# EAGLE schematic MAR (EAGLE 5.11)
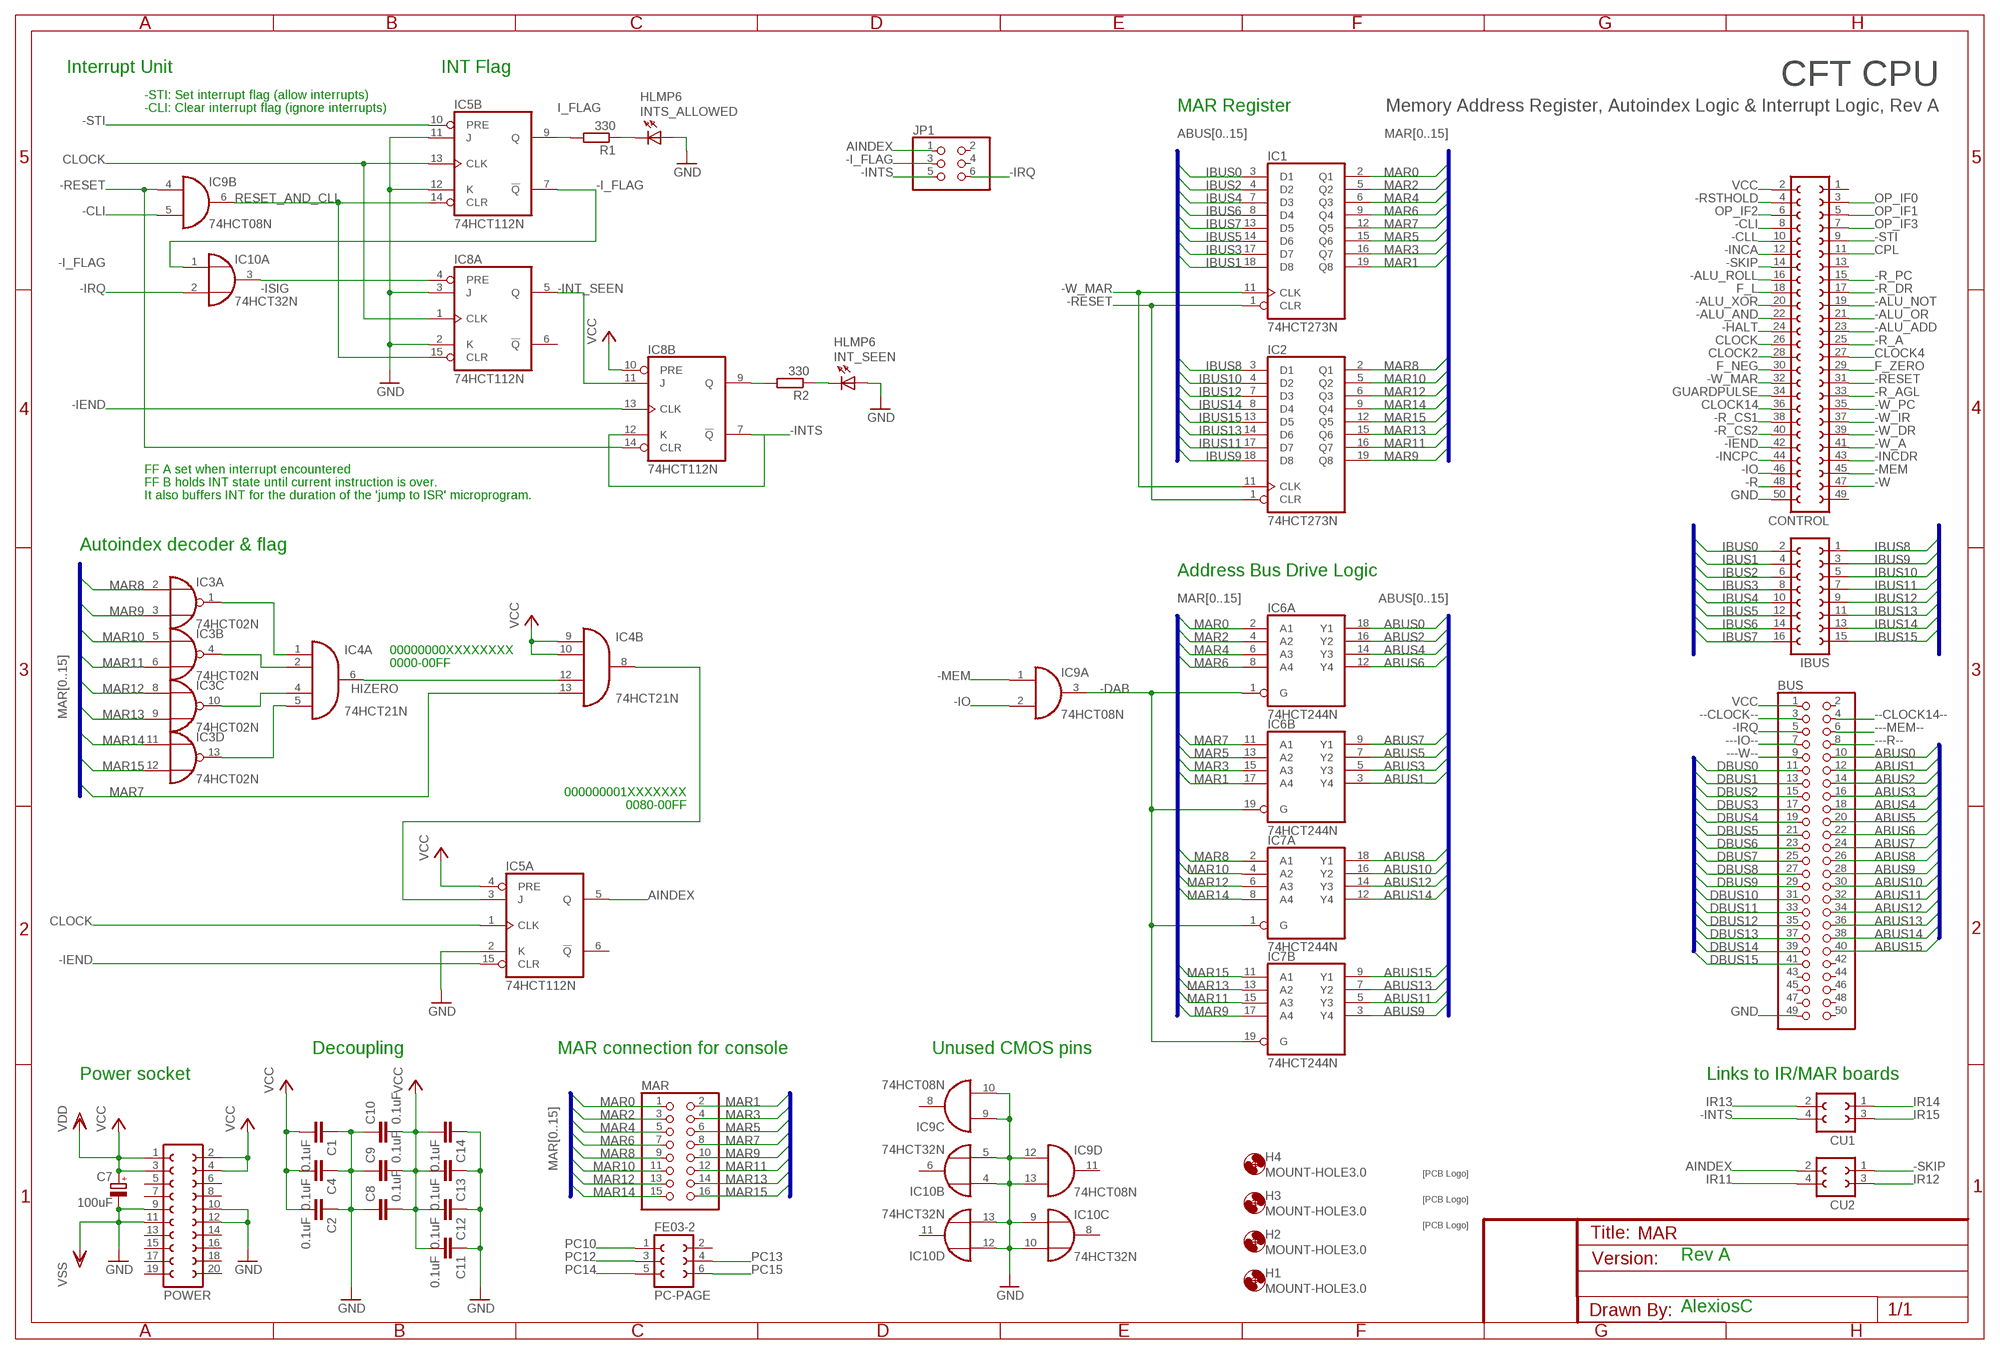
[diagram p0: schematic, sheet 1]

## Parts
BUS  PINHD-2X25/90  [2X25/90]
C1  0.1uF  C-EU025-025X050  [C025-025X050]
C2  0.1uF  C-EU025-025X050  [C025-025X050]
C4  0.1uF  C-EU025-025X050  [C025-025X050]
C7  100uF  CPOL-EUE2.5-6  [E2,5-6]
C8  0.1uF  C-EU025-025X050  [C025-025X050]
C9  0.1uF  C-EU025-025X050  [C025-025X050]
C10  0.1uF  C-EU025-025X050  [C025-025X050]
C11  0.1uF  C-EU025-025X050  [C025-025X050]
C12  0.1uF  C-EU025-025X050  [C025-025X050]
C13  0.1uF  C-EU025-025X050  [C025-025X050]
C14  0.1uF  C-EU025-025X050  [C025-025X050]
CONTROL  FE25-2  [FE25-2]
CU1  FE02-2  [FE02-2]
CU2  FE02-2  [FE02-2]
H1  MOUNT-HOLE3.0  [3,0]
H2  MOUNT-HOLE3.0  [3,0]
H3  MOUNT-HOLE3.0  [3,0]
H4  MOUNT-HOLE3.0  [3,0]
IBUS  FE08-2  [FE08-2]
IC1  74HCT273N  [DIL20]
IC2  74HCT273N  [DIL20]
IC3  74HCT02N  [DIL14]
IC4  74HCT21N  [DIL14]
IC5  74HCT112N  [DIL16]
IC6  74HCT244N  [DIL20]
IC7  74HCT244N  [DIL20]
IC8  74HCT112N  [DIL16]
IC9  74HCT08N  [DIL14]
IC10  74HCT32N  [DIL14]
INT_SEEN  HLMP6  [HLMP6]
INTS_ALLOWED  HLMP6  [HLMP6]
JP1  PINHD-2X3/90  [2X03/90]
MAR  PINHD-2X8/90  [2X08/90]
PC-PAGE  FE03-2  [FE03-2]
POWER  FE10-2  [FE10-2]
R1  330  R-EU_0204/7  [0204/7]
R2  330  R-EU_0204/7  [0204/7]
U$1  SIGNATUREPLANE  [SIGNATURE_PLANE]
U$2  SIGNATUREPLANE  [SIGNATURE_PLANE]
U$3  SIGNATURESILK  [SIGNATURE]

## Nets
---IO--: BUS.7
---MEM--: BUS.6
---R--: BUS.8
---W--: BUS.9
--CLOCK14--: BUS.4
--CLOCK--: BUS.3
-ALU_ADD: CONTROL.23
-ALU_AND: CONTROL.22
-ALU_NOT: CONTROL.19
-ALU_OR: CONTROL.21
-ALU_ROLL: CONTROL.16
-ALU_XOR: CONTROL.20
-CLI: CONTROL.8 IC9.5(B:I1)
-CLL: CONTROL.10
-DAB: IC6.1(A:G) IC6.19(B:G) IC7.1(A:G) IC7.19(B:G) IC9.3(A:O)
-HALT: CONTROL.24
-I_FLAG: IC5.7(B:!Q) IC10.1(A:I0) JP1.3
-IEND: CONTROL.42 IC5.15(A:CLR) IC8.13(B:CLK)
-INCA: CONTROL.12
-INCDR: CONTROL.43
-INCPC: CONTROL.44
-INT_SEEN: IC8.5(A:Q) IC8.11(B:J)
-INTS: CU1.4 IC8.7(B:!Q) IC8.12(B:K) JP1.5
-IO: CONTROL.46 IC9.2(A:I1)
-IRQ: BUS.5 IC10.2(A:I1) JP1.6
-ISIG: IC8.4(A:PRE) IC10.3(A:O)
-MEM: CONTROL.45 IC9.1(A:I0)
-R: CONTROL.48
-R_A: CONTROL.25
-R_AGL: CONTROL.33
-R_CS1: CONTROL.38
-R_CS2: CONTROL.40
-R_DR: CONTROL.17
-R_PC: CONTROL.15
-RESET: CONTROL.31 IC1.1(CLR) IC2.1(CLR) IC8.14(B:CLR) IC9.4(B:I0)
-RSTHOLD: CONTROL.4
-SKIP: CONTROL.14 CU2.1
-STI: CONTROL.9 IC5.10(B:PRE)
-W: CONTROL.47
-W_A: CONTROL.41
-W_DR: CONTROL.39
-W_IR: CONTROL.37
-W_MAR: CONTROL.32 IC1.11(CLK) IC2.11(CLK)
-W_PC: CONTROL.35
ABUS0: BUS.10 IC6.18(A:Y1)
ABUS1: BUS.12 IC6.3(B:Y4)
ABUS2: BUS.14 IC6.16(A:Y2)
ABUS3: BUS.16 IC6.5(B:Y3)
ABUS4: BUS.18 IC6.14(A:Y3)
ABUS5: BUS.20 IC6.7(B:Y2)
ABUS6: BUS.22 IC6.12(A:Y4)
ABUS7: BUS.24 IC6.9(B:Y1)
ABUS8: BUS.26 IC7.18(A:Y1)
ABUS9: BUS.28 IC7.3(B:Y4)
ABUS10: BUS.30 IC7.16(A:Y2)
ABUS11: BUS.32 IC7.5(B:Y3)
ABUS12: BUS.34 IC7.14(A:Y3)
ABUS13: BUS.36 IC7.7(B:Y2)
ABUS14: BUS.38 IC7.12(A:Y4)
ABUS15: BUS.40 IC7.9(B:Y1)
AINDEX: CU2.2 IC5.5(A:Q) JP1.1
CLOCK: CONTROL.26 IC5.1(A:CLK) IC5.13(B:CLK) IC8.1(A:CLK)
CLOCK2: CONTROL.28
CLOCK4: CONTROL.27
CLOCK14: CONTROL.36
CPL: CONTROL.11
DBUS0: BUS.11
DBUS1: BUS.13
DBUS2: BUS.15
DBUS3: BUS.17
DBUS4: BUS.19
DBUS5: BUS.21
DBUS6: BUS.23
DBUS7: BUS.25
DBUS8: BUS.27
DBUS9: BUS.29
DBUS10: BUS.31
DBUS11: BUS.33
DBUS12: BUS.35
DBUS13: BUS.37
DBUS14: BUS.39
DBUS15: BUS.41
F_L: CONTROL.18
F_NEG: CONTROL.30
F_ZERO: CONTROL.29
GND: BUS.49 C1.1 C2.1 C4.1 C7.- C8.1 C9.1 C10.1 C11.1 C12.1 C13.1 C14.1 CONTROL.50 IC5.2(A:K) IC5.11(B:J) IC5.12(B:K) IC8.2(A:K) IC8.3(A:J) IC9.9(C:I0) IC9.10(C:I1) IC9.12(D:I0) IC9.13(D:I1) IC10.4(B:I0) IC10.5(B:I1) IC10.9(C:I0) IC10.10(C:I1) IC10.12(D:I0) IC10.13(D:I1) INT_SEEN.A INTS_ALLOWED.A POWER.9 POWER.10 POWER.11 POWER.12 ; supply symbol labelled VSS
GUARDPULSE: CONTROL.34
HIZERO: IC4.6(A:O) IC4.12(B:I2)
I_FLAG: IC5.9(B:Q) R1.2
IBUS0: IBUS.2 IC1.3(D1)
IBUS1: IBUS.4 IC1.18(D8)
IBUS2: IBUS.6 IC1.4(D2)
IBUS3: IBUS.8 IC1.17(D7)
IBUS4: IBUS.10 IC1.7(D3)
IBUS5: IBUS.12 IC1.14(D6)
IBUS6: IBUS.14 IC1.8(D4)
IBUS7: IBUS.16 IC1.13(D5)
IBUS8: IBUS.1 IC2.3(D1)
IBUS9: IBUS.3 IC2.18(D8)
IBUS10: IBUS.5 IC2.4(D2)
IBUS11: IBUS.7 IC2.17(D7)
IBUS12: IBUS.9 IC2.7(D3)
IBUS13: IBUS.11 IC2.14(D6)
IBUS14: IBUS.13 IC2.8(D4)
IBUS15: IBUS.15 IC2.13(D5)
INTS: IC8.9(B:Q) R2.2
IR11: CU2.4
IR12: CU2.3
IR13: CU1.2
IR14: CU1.1
IR15: CU1.3
MAR0: IC1.2(Q1) IC6.2(A:A1) MAR.1
MAR1: IC1.19(Q8) IC6.17(B:A4) MAR.2
MAR2: IC1.5(Q2) IC6.4(A:A2) MAR.3
MAR3: IC1.16(Q7) IC6.15(B:A3) MAR.4
MAR4: IC1.6(Q3) IC6.6(A:A3) MAR.5
MAR5: IC1.15(Q6) IC6.13(B:A2) MAR.6
MAR6: IC1.9(Q4) IC6.8(A:A4) MAR.7
MAR7: IC1.12(Q5) IC4.13(B:I3) IC6.11(B:A1) MAR.8
MAR8: IC2.2(Q1) IC3.2(A:I0) IC7.2(A:A1) MAR.9
MAR9: IC2.19(Q8) IC3.3(A:I1) IC7.17(B:A4) MAR.10
MAR10: IC2.5(Q2) IC3.5(B:I0) IC7.4(A:A2) MAR.11
MAR11: IC2.16(Q7) IC3.6(B:I1) IC7.15(B:A3) MAR.12
MAR12: IC2.6(Q3) IC3.8(C:I0) IC7.6(A:A3) MAR.13
MAR13: IC2.15(Q6) IC3.9(C:I1) IC7.13(B:A2) MAR.14
MAR14: IC2.9(Q4) IC3.11(D:I0) IC7.8(A:A4) MAR.15
MAR15: IC2.12(Q5) IC3.12(D:I1) IC7.11(B:A1) MAR.16
N$1: IC3.1(A:O) IC4.1(A:I0)
N$2: IC3.4(B:O) IC4.2(A:I1)
N$3: IC3.10(C:O) IC4.4(A:I2)
N$4: IC3.13(D:O) IC4.5(A:I3)
N$5: IC4.8(B:O) IC5.3(A:J)
N$6: INT_SEEN.K R2.1
N$7: INTS_ALLOWED.K R1.1
OP_IF0: CONTROL.3
OP_IF1: CONTROL.5
OP_IF2: CONTROL.6
OP_IF3: CONTROL.7
PC10: PC-PAGE.1
PC12: PC-PAGE.3
PC13: PC-PAGE.4
PC14: PC-PAGE.5
PC15: PC-PAGE.6
RESET_AND_CLI: IC5.14(B:CLR) IC8.15(A:CLR) IC9.6(B:O)
VCC: BUS.1 C1.2 C2.2 C4.2 C7.+ C8.2 C9.2 C10.2 C11.2 C12.2 C13.2 C14.2 CONTROL.2 IC4.9(B:I0) IC4.10(B:I1) IC5.4(A:PRE) IC8.10(B:PRE) POWER.1 POWER.2 POWER.3 POWER.4 ; supply symbol labelled VDD
Unconnected: BUS.2 BUS.42 BUS.43 BUS.44 BUS.45 BUS.46 BUS.47 BUS.48 BUS.50 CONTROL.1 CONTROL.13 CONTROL.49 IC5.6(A:!Q) IC8.6(A:!Q) IC9.8(C:O) IC9.11(D:O) IC10.6(B:O) IC10.8(C:O) IC10.11(D:O) JP1.2 JP1.4 PC-PAGE.2 POWER.5 POWER.6 POWER.7 POWER.8 POWER.13 POWER.14 POWER.15 POWER.16 POWER.17 POWER.18 POWER.19 POWER.20

## Buses
IBUS[0..15]
MAR[0..15]
ABUS[0..15]
DBUS[0..15]

## Notes on the sheet
- Interrupt Unit | INT Flag
- CFT CPU
- -STI: Set interrupt flag (allow interrupts)
- -CLI: Clear interrupt flag (ignore interrupts) | MAR Register | Memory Address Register, Autoindex Logic & Interrupt Logic, Rev A
- FF A set when interrupt encountered
- FF B holds INT state until current instruction is over.
- It also buffers INT for the duration of the 'jump to ISR' microprogram.
- Autoindex decoder & flag
- Address Bus Drive Logic
- 00000000XXXXXXXX
- 0000-00FF
- 000000001XXXXXXX
- 0080-00FF
- Decoupling | MAR connection for console | Unused CMOS pins
- Power socket | Links to IR/MAR boards
- Rev A
- AlexiosC

## Power pins joined to a net without a drawn wire
GND: IC1.10(GND) IC2.10(GND) IC3.7(P:GND) IC4.7(P:GND) IC5.8(P:GND) IC6.10(P:GND) IC7.10(P:GND) IC8.8(P:GND) IC9.7(P:GND) IC10.7(P:GND)
VCC: IC1.20(VCC) IC2.20(VCC) IC3.14(P:VCC) IC4.14(P:VCC) IC5.16(P:VCC) IC6.20(P:VCC) IC7.20(P:VCC) IC8.16(P:VCC) IC9.14(P:VCC) IC10.14(P:VCC)

## Library data of the parts
BUS = pinhead:PINHD-2X25: PIN HEADER
C1 C2 C4 C8-C14 = rcl:C-EU: CAPACITOR, European symbol
C7 = rcl:CPOL-EU: POLARIZED CAPACITOR, European symbol
CONTROL = con-lsta:FE25-2: FEMALE HEADER
CU1 CU2 = alexios:FE02-2: A 2x2 pin female header.
H1-H4 = holes:MOUNT-HOLE: MOUNTING HOLE with drill center marker
IBUS = con-lsta:FE08-2: FEMALE HEADER
IC1 IC2 = 74xx-eu:74*273: Octal D type FLIP FLOP, clear
IC3 = 74xx-eu:74*02: Quad 2-input NOR gate
IC4 = 74xx-eu:74*21: Dual 4-input AND gate
IC5 IC8 = 74xx-eu:74*112: Dual J-K negative edge triggered FLIP FLOP, preset and clear
IC6 IC7 = 74xx-eu:74*244: Octal BUFFER and LINE DRIVER, 3-state
IC9 = 74xx-eu:74*08: Quad 2-input AND gate
IC10 = 74xx-eu:74*32: Quad 2-input OR gate
INT_SEEN INTS_ALLOWED = display-hp:HLMP6: LED 2mm horizontal; MF: AGILENT TECHNOLOGIES; MPN: HLMP-6500; OC_FARNELL: 1652490; OC_NEWARK: 40K0088
JP1 = pinhead:PINHD-2X3: PIN HEADER
MAR = pinhead:PINHD-2X8: PIN HEADER
PC-PAGE = alexios:FE03-2: A 2x3 female header.
POWER = con-lsta:FE10-2: FEMALE HEADER; OC_FARNELL: unknown; OC_NEWARK: unknown
R1 R2 = resistor:R-EU_: RESISTOR, European symbol
U$1-U$3 = alexios:SIGNATURE: Soup signature

## Net classes
0 default: width 0.406 mm, clearance 0.305 mm
1 Decoupling: width 1.27 mm